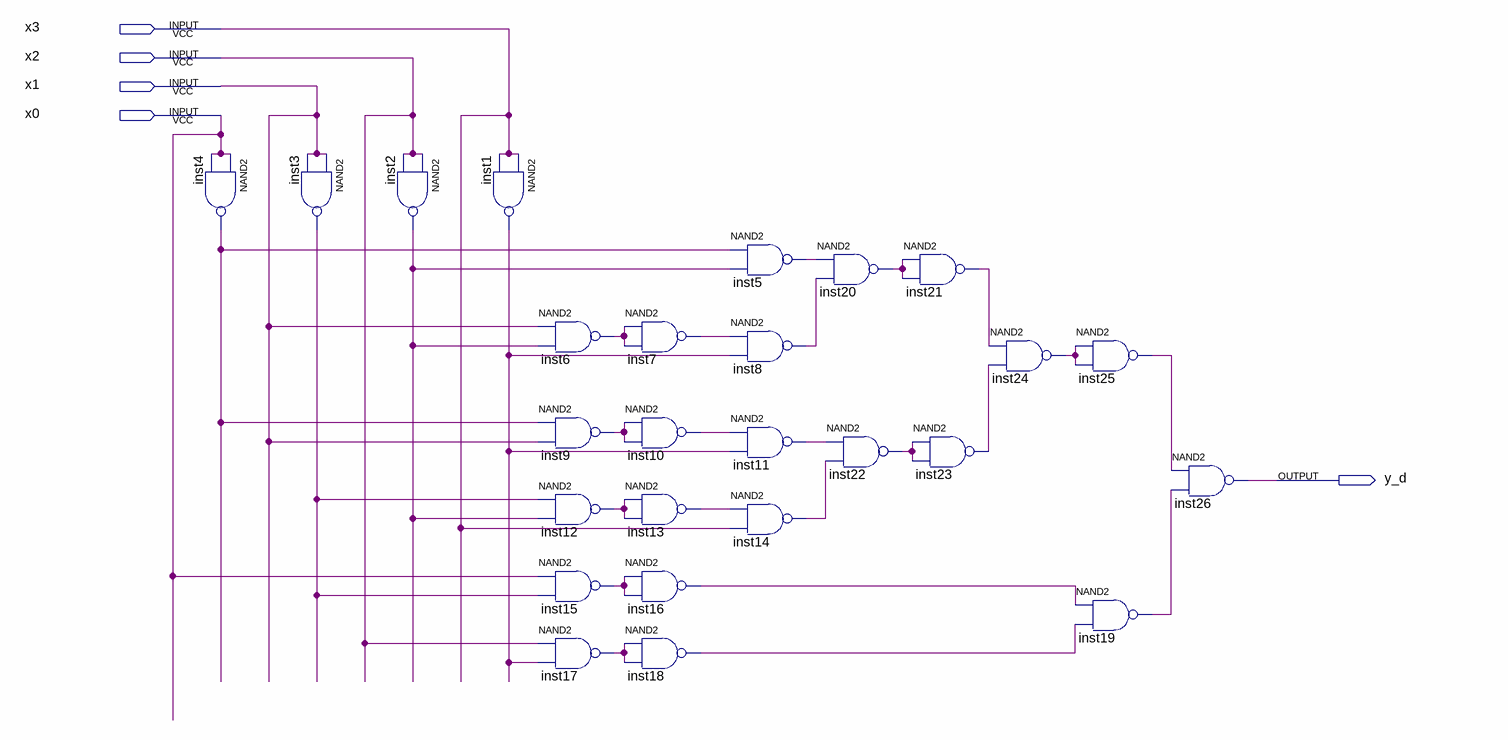
[diagram p0: schematic sheet]
// Quartus schematic y_d.bdf as structural Verilog: 26 symbols, 5 pins
module y_d (
  input  x3,
  input  x2,
  input  x1,
  input  x0,
  output y_d
);

  wire inst1_out, inst2_out, inst3_out, inst4_out, inst5_out, inst6_out, inst7_out, inst8_out, inst9_out,
       inst10_out, inst11_out, inst12_out, inst13_out, inst14_out, inst15_out, inst16_out, inst17_out,
       inst18_out, inst19_out, inst20_out, inst21_out, inst22_out, inst23_out, inst24_out, inst25_out;

  nand inst4 (inst4_out, x0, x0);
  nand inst3 (inst3_out, x1, x1);
  nand inst2 (inst2_out, x2, x2);
  nand inst1 (inst1_out, x3, x3);
  nand inst6 (inst6_out, x1, inst2_out);
  nand inst9 (inst9_out, inst4_out, x1);
  nand inst12 (inst12_out, inst3_out, inst2_out);
  nand inst15 (inst15_out, x0, inst3_out);
  nand inst17 (inst17_out, x2, inst1_out);
  nand inst7 (inst7_out, inst6_out, inst6_out);
  nand inst10 (inst10_out, inst9_out, inst9_out);
  nand inst13 (inst13_out, inst12_out, inst12_out);
  nand inst16 (inst16_out, inst15_out, inst15_out);
  nand inst18 (inst18_out, inst17_out, inst17_out);
  nand inst5 (inst5_out, inst4_out, inst2_out);
  nand inst8 (inst8_out, inst7_out, inst1_out);
  nand inst11 (inst11_out, inst10_out, inst1_out);
  nand inst14 (inst14_out, inst13_out, x3);
  nand inst20 (inst20_out, inst5_out, inst8_out);
  nand inst22 (inst22_out, inst11_out, inst14_out);
  nand inst21 (inst21_out, inst20_out, inst20_out);
  nand inst23 (inst23_out, inst22_out, inst22_out);
  nand inst24 (inst24_out, inst21_out, inst23_out);
  nand inst25 (inst25_out, inst24_out, inst24_out);
  nand inst19 (inst19_out, inst16_out, inst18_out);
  nand inst26 (y_d, inst25_out, inst19_out);
endmodule
